# EAGLE design pcb1f (EAGLE 9.6.2)
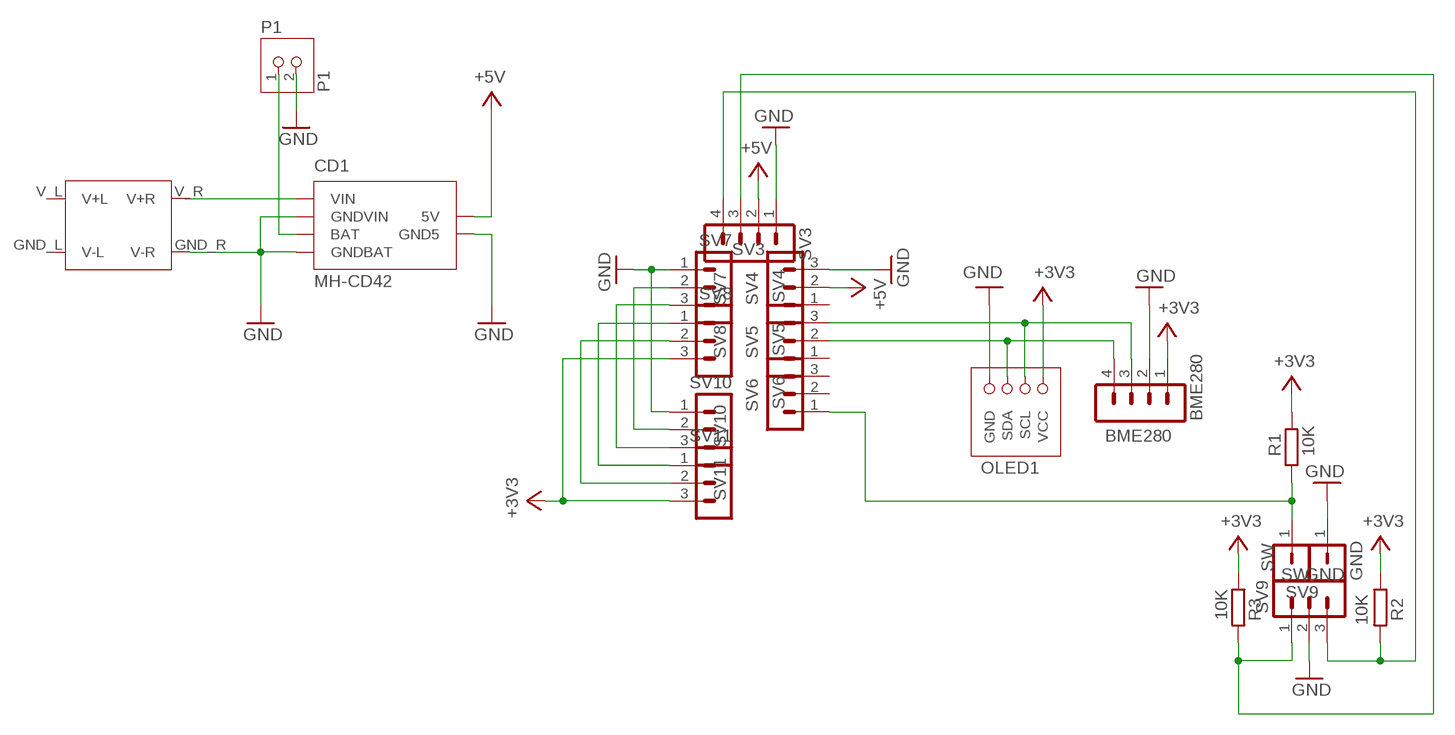
[diagram p0: schematic, sheet 1]

## Parts
BME280  BME280  PINHEAD-MA04-1  [PINHEAD-MA04-1]
CD1  MH-CD42  [MH-CD42]
GND  GND  PINHEAD-MA01-1  [PINHEAD-MA01-1]
OLED1  OLED-SSD1306-0.96  [OLED-I2C-0.96]
P1  P1  JST-PH2  [JST-PH2]
R1  10K  R-EU_0204/5  [0204/5]
R2  10K  R-EU_0204/5  [0204/5]
R3  10K  R-EU_0204/5  [0204/5]
SV3  SV3  PINHEAD-MA04-1  [PINHEAD-MA04-1]
SV4  SV4  PINHEAD-MA03-1  [PINHEAD-MA03-1]
SV5  SV5  PINHEAD-MA03-1  [PINHEAD-MA03-1]
SV6  SV6  PINHEAD-MA03-1  [PINHEAD-MA03-1]
SV7  SV7  PINHEAD-MA03-1  [PINHEAD-MA03-1]
SV8  SV8  PINHEAD-MA03-1  [PINHEAD-MA03-1]
SV9  SV9  PINHEAD-MA03-1  [PINHEAD-MA03-1]
SV10  SV10  PINHEAD-MA03-1  [PINHEAD-MA03-1]
SV11  SV11  PINHEAD-MA03-1  [PINHEAD-MA03-1]
SW  SW  PINHEAD-MA01-1  [PINHEAD-MA01-1]
U$1  AE-USB2.0-TYPE-C-CTRPB-1  [AE-USB2.0-TYPE-C-CTRPB-1]

## Nets
+3V3: BME280.1 OLED1.VCC R1.2 R2.1 R3.1 SV8.3 SV11.3
+5V: CD1.5V SV3.2 SV4.2
BAT+: CD1.BAT P1.1
GND: BME280.2 CD1.GND5V(GND5) CD1.GNDBAT CD1.GNDVIN GND.1 OLED1.GND P1.2 SV3.1 SV4.3 SV7.1 SV9.2 SV10.1 U$1.GND_R(V-R)
N$1: CD1.VIN U$1.V_R(V+R)
N$2: BME280.3 OLED1.SCL SV5.3
N$3: BME280.4 OLED1.SDA SV5.2
N$4: SV7.2 SV10.2
N$5: R1.1 SV6.1 SW.1
N$6: R3.2 SV3.3 SV9.1
N$7: SV7.3 SV10.3
N$8: SV8.1 SV11.1
N$9: SV8.2 SV11.2
N$11: R2.2 SV3.4 SV9.3
Unconnected: SV4.1 SV5.1 SV6.2 SV6.3 U$1.GND_L(V-L) U$1.V_L(V+L)

## Library data of the parts
BME280 SV3 = ytani1:PINHEAD-MA04-1: PIN HEADER; OC_FARNELL: unknown; OC_NEWARK: unknown
CD1 = ytani1:MH-CD42
GND SW = ytani1:PINHEAD-MA01-1
OLED1 = ytani1:OLED-SSD1306-0.96: OLED SSD1306 0.96inch 128x96 I2C https://akizukidenshi.com/catalog/g/gP-12031/ Vcc: 3V-5.5V I2C addr: 0x3C Control chip: SSD1306 Blank/White; OC_AKIZUKI: P-12031; URL_AKIZUKI: https://akizukidenshi.com/catalog/g/gP-12031/
P1 = ytani1:JST-PH2
R1-R3 = rcl:R-EU_: RESISTOR, European symbol; SPICEPREFIX: R
SV4-SV11 = ytani1:PINHEAD-MA03-1: PIN HEADER; OC_FARNELL: unknown; OC_NEWARK: unknown
U$1 = ytani1:AE-USB2.0-TYPE-C-CTRPB-1

## Board
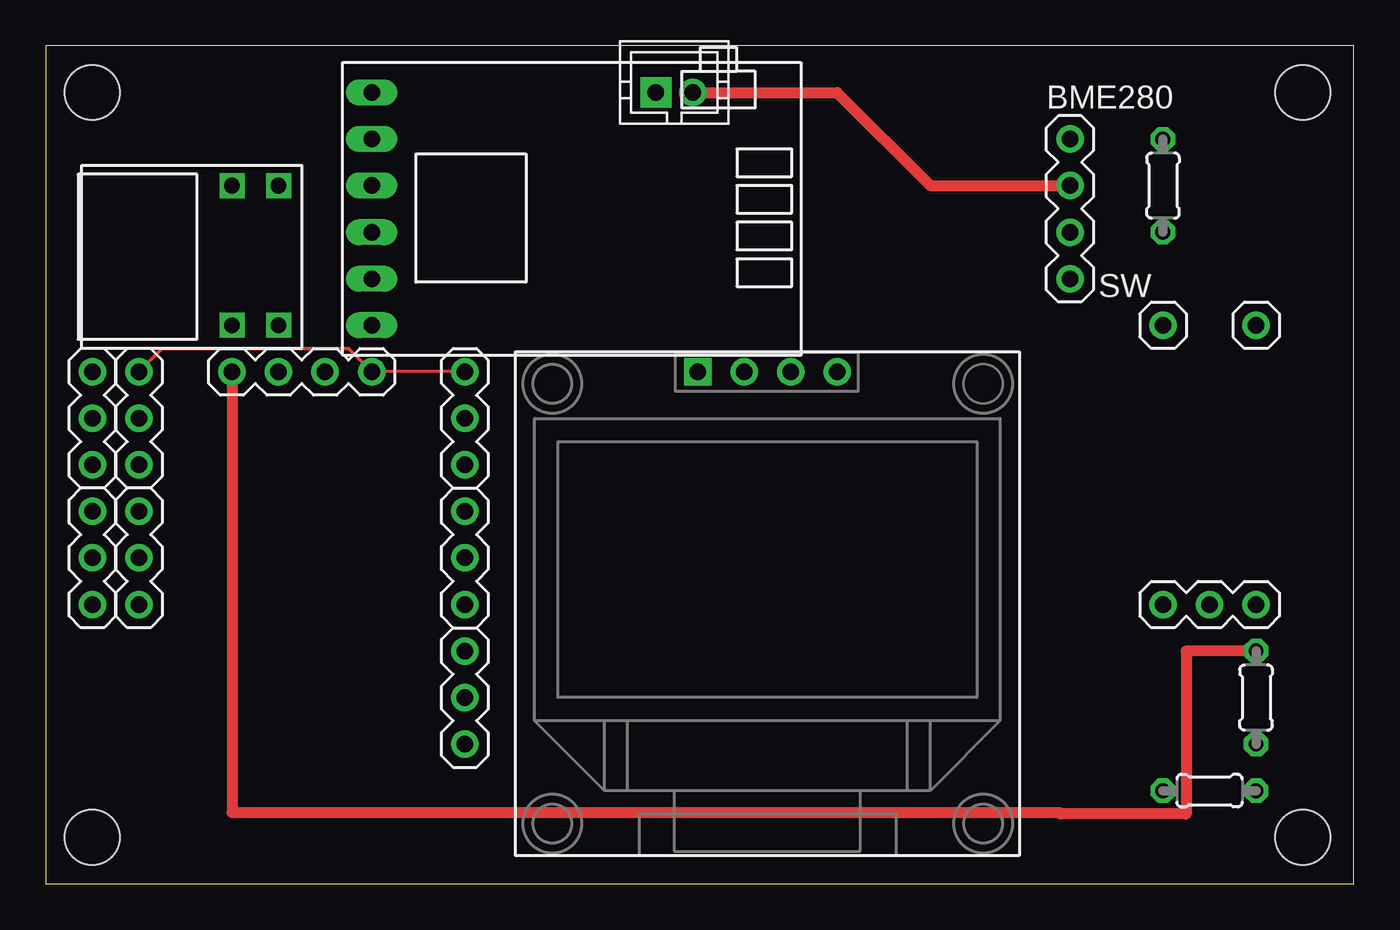
[diagram p1: board, top side]
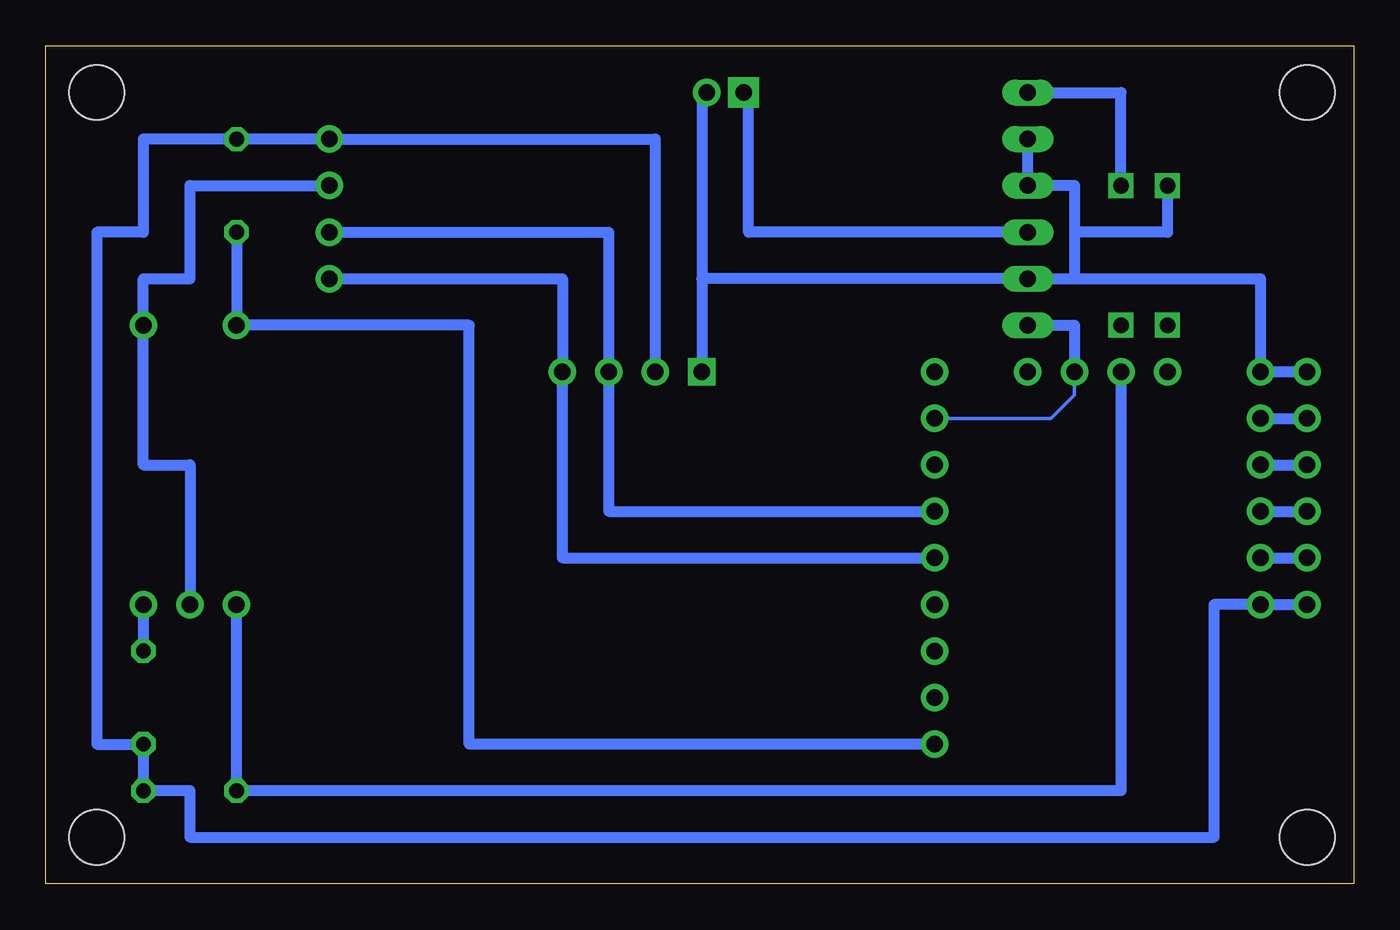
[diagram p2: board, bottom side, seen from below]

Size 71.36 x 45.73 mm. Coordinates in mm from the lower left corner, seen from the top.
Outline: 0,0 71.36,0 71.36,45.73 0,45.73 0,0
Copper layers (1*16): Top 0.035mm / dielectric 1.5mm / Bottom 0.035mm
Design rules "default": minimum track width 6mil, minimum drill 0.35mm, track to track 6mil, track to pad 6mil, pad to pad 6mil, via to via 6mil, smd to smd 6mil, copper to edge 40mil, drill to drill 6mil, minimum pad ring 10mil, minimum via ring 8mil, stop-mask expansion 4mil, vias tented up to drill 0mil, thermal gap 10mil
Holes 3 mm at 2.54,43.18 2.54,2.54 68.58,43.18 68.58,2.54

### Footprints (pad centres in the part's own frame; a part is rotated, then mirrored left to right if it is on the bottom)
PINHEAD-MA04-1 = drill 0.9 pad 1.5: 1 -3.81,0; 2 -1.27,0; 3 1.27,0; 4 3.81,0
MH-CD42 = drill 0.9 long: 5V 10.16,6.35; BAT 10.16,1.27; GND5V 10.16,3.81; GNDBAT 10.16,-1.27; GNDVIN 10.16,-3.81; VIN 10.16,-6.35
PINHEAD-MA01-1 = drill 0.9 pad 1.5: 1 1.27,0
OLED-I2C-0.96 = drill 0.9 pad 1.5 square: GND -5.08,10.16 | drill 0.9 pad 1.5: SCL 0,10.16; SDA 2.54,10.16; VCC -2.54,10.16
JST-PH2 = drill 0.9 pad 1.676 square: 1 -1,0 | drill 0.9 pad 1.5: 2 1,0
0204/5 = drill 0.813 octagon: 1 -2.54,0; 2 2.54,0
PINHEAD-MA03-1 = drill 0.9 pad 1.5: 1 -1.27,0; 2 1.27,0; 3 3.81,0
AE-USB2.0-TYPE-C-CTRPB-1 = drill 0.85 square: GND_L -2.54,0; GND_R 5.08,0; V_L -2.54,-2.54; V_R 5.08,-2.54

### Placement (x,y rotation side)
BME280  55.88,36.83 270 top
CD1  27.94,36.83 180 top
GND  64.77,30.48 0 top
OLED1  40.64,17.78 0 top
P1  34.29,43.18 0 top
R1  60.96,38.1 90 top
R2  66.04,10.16 90 top
R3  63.5,5.08 180 top
SV3  13.97,27.94 180 top
SV4  22.86,24.13 90 top
SV5  22.86,16.51 90 top
SV6  22.86,8.89 90 top
SV7  5.08,26.67 270 top
SV8  5.08,19.05 270 top
SV9  62.23,15.24 0 top
SV10  2.54,26.67 270 top
SV11  2.54,19.05 270 top
SW  59.69,30.48 0 top
U$1  10.16,33.02 90 top

### Tracks (layer width: path | path; a pad name or v marks a point on that pad's centre or on a via)
+3V3
  Bottom 0.61: OLED1.VCC 38.1,40.64 BME280.1 R1.2 66.04,40.64 66.04,35.56 68.58,35.56 68.58,7.62 R2.1 R3.1 63.5,5.08 63.5,2.54 7.62,2.54 7.62,15.24 SV8.3 SV11.3
+5V
  Bottom 0.2: SV3.2 15.24,26.67 16.51,25.4 SV4.2
  Bottom 0.61: CD1.5V 15.24,30.48 SV3.2
BAT+
  Bottom 0.61: CD1.BAT 33.02,35.56 33.02,43.18 P1.1
GND
  Top 0.152: SV4.3 SV3.1
  Top 0.2: SV7.1 6.35,29.21 16.51,29.21 SV3.1
  Top 0.61: BME280.2 48.26,38.1 43.18,43.18 P1.2
  Bottom 0.61: SV10.1 SV7.1 5.08,33.02 15.24,33.02 | SV9.2 63.5,22.86 66.04,22.86 GND.1 66.04,33.02 63.5,33.02 63.5,38.1 BME280.2 | 35.56,33.02 OLED1.GND | 35.56,33.02 CD1.GND5V 15.24,33.02 | P1.2 35.56,42.91 35.56,33.02 | 15.24,35.56 15.24,38.1 CD1.GNDBAT CD1.GNDVIN | 15.24,35.56 15.24,33.02 | U$1.GND_R 10.16,35.56 15.24,35.56
N$1
  Bottom 0.61: CD1.VIN 12.7,43.18 U$1.V_R
N$2
  Bottom 0.61: SV5.3 40.64,20.32 OLED1.SCL 40.64,35.56 BME280.3
N$3
  Bottom 0.61: SV5.2 43.18,17.78 OLED1.SDA 43.18,33.02 BME280.4
N$4
  Bottom 0.61: SV7.2 SV10.2
N$5
  Bottom 0.61: SV6.1 48.26,7.62 48.26,30.48 SW.1 R1.1
N$6
  Bottom 0.61: SV3.3 12.7,5.08 R3.2 SV9.1
N$7
  Bottom 0.61: SV7.3 SV10.3
N$8
  Bottom 0.61: SV8.1 SV11.1
N$9
  Bottom 0.61: SV8.2 SV11.2
N$11
  Top 0.61: SV3.4 10.16,3.87 55.31,3.87 55.37,3.81 62.23,3.81 62.23,12.7 R2.2
  Bottom 0.61: SV9.3 R2.2